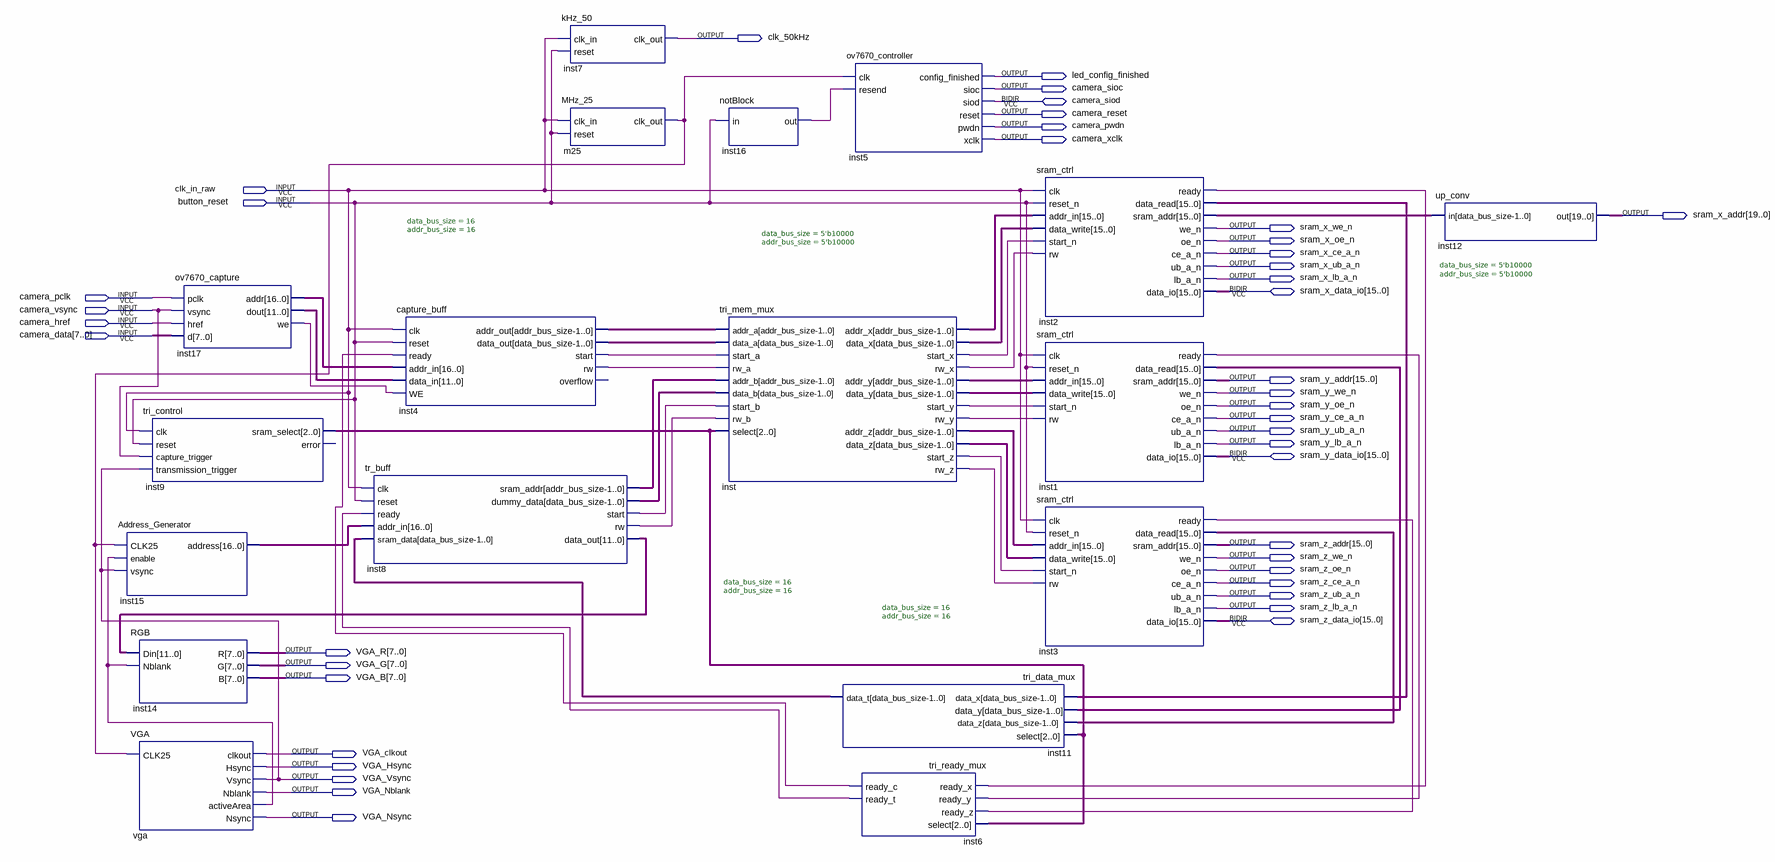
[diagram p0: schematic sheet]
// Quartus schematic TripleBuffer_top.bdf as structural Verilog: 18 symbols, 42 pins
module TripleBuffer_top (
  input  clk_in_raw,
  input  button_reset,
  input  camera_pclk,
  input  camera_vsync,
  input  camera_href,
  input  [7:0] camera_data,
  inout  camera_siod,
  inout  [15:0] sram_x_data_io,
  inout  [15:0] sram_y_data_io,
  inout  [15:0] sram_z_data_io,
  output clk_50kHz,
  output led_config_finished,
  output camera_sioc,
  output camera_reset,
  output camera_pwdn,
  output camera_xclk,
  output [19:0] sram_x_addr,
  output sram_x_we_n,
  output sram_x_oe_n,
  output sram_x_ce_a_n,
  output sram_x_ub_a_n,
  output sram_x_lb_a_n,
  output [15:0] sram_y_addr,
  output sram_y_we_n,
  output sram_y_oe_n,
  output sram_y_ce_a_n,
  output sram_y_ub_a_n,
  output sram_y_lb_a_n,
  output [15:0] sram_z_addr,
  output sram_z_we_n,
  output sram_z_oe_n,
  output sram_z_ce_a_n,
  output sram_z_ub_a_n,
  output sram_z_lb_a_n,
  output [7:0] VGA_R,
  output [7:0] VGA_G,
  output [7:0] VGA_B,
  output VGA_clkout,
  output VGA_Hsync,
  output VGA_Vsync,
  output VGA_Nblank,
  output VGA_Nsync
);

  wire inst1_ready, inst2_ready, inst3_ready, inst4_rw, inst4_start, inst6_ready_c, inst6_ready_t, inst8_rw,
       inst8_start, inst16_out, inst17_we, inst_rw_x, inst_rw_y, inst_rw_z, inst_start_x, inst_start_y,
       inst_start_z, m25_clk_out, vga_activearea;
  wire [2:0] inst9_sram_select;
  wire [11:0] inst8_data_out, inst17_dout;
  wire [15:0] inst1_data_read, inst2_data_read, inst2_sram_addr, inst3_data_read, inst4_addr_out,
       inst4_data_out, inst8_dummy_data, inst8_sram_addr, inst11_data_t, inst_addr_x, inst_addr_y,
       inst_addr_z, inst_data_x, inst_data_y, inst_data_z;
  wire [16:0] inst15_address, inst17_addr;

  tri_control inst9 (
    .clk(clk_in_raw), .reset(button_reset), .capture_trigger(camera_vsync), .transmission_trigger(VGA_Vsync),
    .sram_select(inst9_sram_select));  // open: error
  Address_Generator inst15 (.CLK25(m25_clk_out), .enable(vga_activearea), .vsync(VGA_Vsync), .address(inst15_address));
  RGB inst14 (.Din(inst8_data_out), .Nblank(vga_activearea), .R(VGA_R), .G(VGA_G), .B(VGA_B));
  VGA vga (
    .CLK25(m25_clk_out), .clkout(VGA_clkout), .Hsync(VGA_Hsync), .Vsync(VGA_Vsync), .Nblank(VGA_Nblank),
    .activeArea(vga_activearea), .Nsync(VGA_Nsync));
  ov7670_capture inst17 (
    .pclk(camera_pclk), .vsync(camera_vsync), .href(camera_href), .d(camera_data), .addr(inst17_addr),
    .dout(inst17_dout), .we(inst17_we));
  capture_buff #(.data_bus_size(16), .addr_bus_size(16)) inst4 (
    .clk(clk_in_raw), .reset(button_reset), .ready(inst6_ready_c), .addr_in(inst17_addr),
    .data_in(inst17_dout), .WE(inst17_we), .addr_out(inst4_addr_out), .data_out(inst4_data_out),
    .start(inst4_start), .rw(inst4_rw));  // open: overflow
  tr_buff #(.data_bus_size(16), .addr_bus_size(16)) inst8 (
    .clk(clk_in_raw), .reset(button_reset), .ready(inst6_ready_t), .addr_in(inst15_address),
    .sram_data(inst11_data_t), .sram_addr(inst8_sram_addr), .dummy_data(inst8_dummy_data),
    .start(inst8_start), .rw(inst8_rw), .data_out(inst8_data_out));
  kHz_50 inst7 (.clk_in(clk_in_raw), .reset(button_reset), .clk_out(clk_50kHz));
  MHz_25 m25 (.clk_in(clk_in_raw), .reset(button_reset), .clk_out(m25_clk_out));
  notBlock inst16 (.in(button_reset), .out(inst16_out));
  tri_mem_mux #(.data_bus_size(5'b10000), .addr_bus_size(5'b10000)) inst (
    .addr_a(inst4_addr_out), .data_a(inst4_data_out), .start_a(inst4_start), .rw_a(inst4_rw),
    .addr_b(inst8_sram_addr), .data_b(inst8_dummy_data), .start_b(inst8_start), .rw_b(inst8_rw),
    .select(inst9_sram_select), .addr_x(inst_addr_x), .data_x(inst_data_x), .start_x(inst_start_x),
    .rw_x(inst_rw_x), .addr_y(inst_addr_y), .data_y(inst_data_y), .start_y(inst_start_y), .rw_y(inst_rw_y),
    .addr_z(inst_addr_z), .data_z(inst_data_z), .start_z(inst_start_z), .rw_z(inst_rw_z));
  ov7670_controller inst5 (
    .clk(m25_clk_out), .resend(inst16_out), .config_finished(led_config_finished), .sioc(camera_sioc),
    .reset(camera_reset), .pwdn(camera_pwdn), .xclk(camera_xclk), .siod(camera_siod));
  tri_data_mux #(.data_bus_size(16), .addr_bus_size(16)) inst11 (
    .data_x(inst2_data_read), .data_y(inst1_data_read), .data_z(inst3_data_read), .select(inst9_sram_select),
    .data_t(inst11_data_t));
  tri_ready_mux inst6 (
    .ready_x(inst2_ready), .ready_y(inst1_ready), .ready_z(inst3_ready), .select(inst9_sram_select),
    .ready_c(inst6_ready_c), .ready_t(inst6_ready_t));
  sram_ctrl inst2 (
    .clk(clk_in_raw), .reset_n(button_reset), .addr_in(inst_addr_x), .data_write(inst_data_x),
    .start_n(inst_start_x), .rw(inst_rw_x), .ready(inst2_ready), .data_read(inst2_data_read),
    .sram_addr(inst2_sram_addr), .we_n(sram_x_we_n), .oe_n(sram_x_oe_n), .ce_a_n(sram_x_ce_a_n),
    .ub_a_n(sram_x_ub_a_n), .lb_a_n(sram_x_lb_a_n), .data_io(sram_x_data_io));
  sram_ctrl inst1 (
    .clk(clk_in_raw), .reset_n(button_reset), .addr_in(inst_addr_y), .data_write(inst_data_y),
    .start_n(inst_start_y), .rw(inst_rw_y), .ready(inst1_ready), .data_read(inst1_data_read),
    .sram_addr(sram_y_addr), .we_n(sram_y_we_n), .oe_n(sram_y_oe_n), .ce_a_n(sram_y_ce_a_n),
    .ub_a_n(sram_y_ub_a_n), .lb_a_n(sram_y_lb_a_n), .data_io(sram_y_data_io));
  sram_ctrl inst3 (
    .clk(clk_in_raw), .reset_n(button_reset), .addr_in(inst_addr_z), .data_write(inst_data_z),
    .start_n(inst_start_z), .rw(inst_rw_z), .ready(inst3_ready), .data_read(inst3_data_read),
    .sram_addr(sram_z_addr), .we_n(sram_z_we_n), .oe_n(sram_z_oe_n), .ce_a_n(sram_z_ce_a_n),
    .ub_a_n(sram_z_ub_a_n), .lb_a_n(sram_z_lb_a_n), .data_io(sram_z_data_io));
  up_conv #(.data_bus_size(5'b10000), .addr_bus_size(5'b10000)) inst12 (.in(inst2_sram_addr), .out(sram_x_addr));
endmodule
